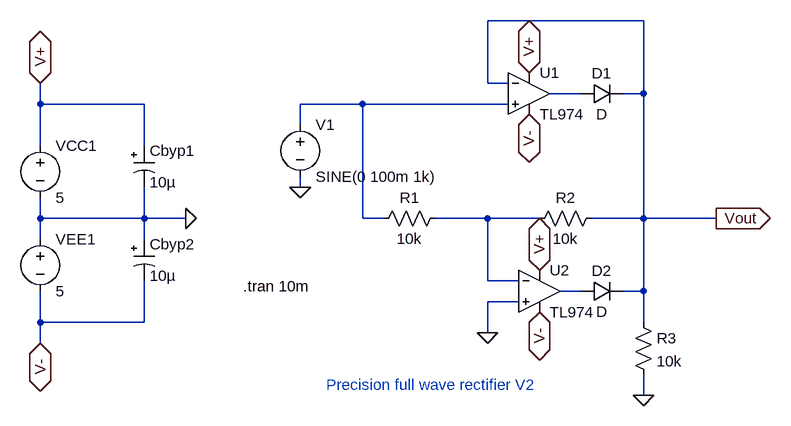
[diagram p0: schematic Precision_Fullwave_Rectifier_V2.asc]
Precision_Fullwave_Rectifier_V2.asc, the LTspice schematic file:
Version 4
SHEET 1 1232 680
WIRE 992 -272 752 -272
WIRE 752 -176 752 -272
WIRE 784 -176 752 -176
WIRE 896 -160 848 -160
WIRE 992 -160 992 -272
WIRE 992 -160 960 -160
WIRE 64 -144 64 -176
WIRE 224 -144 64 -144
WIRE 560 -144 464 -144
WIRE 784 -144 560 -144
WIRE 464 -112 464 -144
WIRE 64 -80 64 -144
WIRE 224 -80 224 -144
WIRE 464 -16 464 -32
WIRE 64 32 64 0
WIRE 224 32 224 -16
WIRE 224 32 64 32
WIRE 288 32 224 32
WIRE 560 32 560 -144
WIRE 592 32 560 32
WIRE 752 32 672 32
WIRE 832 32 752 32
WIRE 992 32 992 -160
WIRE 992 32 912 32
WIRE 1104 32 992 32
WIRE 64 64 64 32
WIRE 224 64 224 32
WIRE 752 128 752 32
WIRE 800 128 752 128
WIRE 896 144 864 144
WIRE 992 144 992 32
WIRE 992 144 960 144
WIRE 800 160 752 160
WIRE 64 192 64 144
WIRE 224 192 224 128
WIRE 224 192 64 192
WIRE 992 192 992 144
WIRE 752 208 752 160
WIRE 64 224 64 192
WIRE 992 304 992 272
FLAG 288 32 0
FLAG 64 -176 V+
IOPIN 64 -176 BiDir
FLAG 64 224 V-
IOPIN 64 224 BiDir
FLAG 464 -16 0
FLAG 816 -192 V+
IOPIN 816 -192 BiDir
FLAG 816 -128 V-
IOPIN 816 -128 BiDir
FLAG 832 112 V+
IOPIN 832 112 BiDir
FLAG 832 176 V-
IOPIN 832 176 BiDir
FLAG 752 208 0
FLAG 992 304 0
FLAG 1104 32 Vout
IOPIN 1104 32 Out
SYMBOL voltage 64 -96 R0
SYMATTR InstName VCC1
SYMATTR Value 5
SYMBOL voltage 64 48 R0
SYMATTR InstName VEE1
SYMATTR Value 5
SYMBOL polcap 208 -80 R0
SYMATTR InstName Cbyp1
SYMATTR Value 10µ
SYMBOL polcap 208 64 R0
SYMATTR InstName Cbyp2
SYMATTR Value 10µ
SYMBOL voltage 464 -128 R0
WINDOW 123 0 0 Left 0
WINDOW 39 0 0 Left 0
SYMATTR InstName V1
SYMATTR Value SINE(0 100m 1k)
SYMBOL ECE3161\\TL974 816 -160 R0
SYMATTR InstName U1
SYMBOL diode 896 -144 R270
WINDOW 0 32 32 VTop 2
WINDOW 3 0 32 VBottom 2
SYMATTR InstName D1
SYMBOL res 688 16 R90
WINDOW 0 0 56 VBottom 2
WINDOW 3 32 56 VTop 2
SYMATTR InstName R1
SYMATTR Value 10k
SYMBOL res 928 16 R90
WINDOW 0 0 56 VBottom 2
WINDOW 3 32 56 VTop 2
SYMATTR InstName R2
SYMATTR Value 10k
SYMBOL ECE3161\\TL974 832 144 R0
SYMATTR InstName U2
SYMBOL diode 896 160 R270
WINDOW 0 32 32 VTop 2
WINDOW 3 0 32 VBottom 2
SYMATTR InstName D2
SYMBOL res 976 176 R0
SYMATTR InstName R3
SYMATTR Value 10k
TEXT 504 288 Left 2 ;Precision full wave rectifier V2
TEXT 376 136 Left 2 !.tran 10m

The netlist it stands for:
* Precision_Fullwave_Rectifier_V2.asc
VCC1 V+ 0 5
VEE1 0 V- 5
Cbyp1 V+ 0 10µ
Cbyp2 0 V- 10µ
V1 N002 0 SINE(0 100m 1k)
XU1 N002 Vout V+ V- N001 TL974  ; pins In+ In- V+ V- OUT
D1 N001 Vout D
R1 N003 N002 10k
R2 Vout N003 10k
XU2 0 N003 V+ V- N004 TL974  ; pins In+ In- V+ V- OUT
D2 N004 Vout D
R3 Vout 0 10k
.model D D
.lib standard.dio
* Precision full wave rectifier V2
.tran 10m
.lib TL974.mod
.backanno
.end